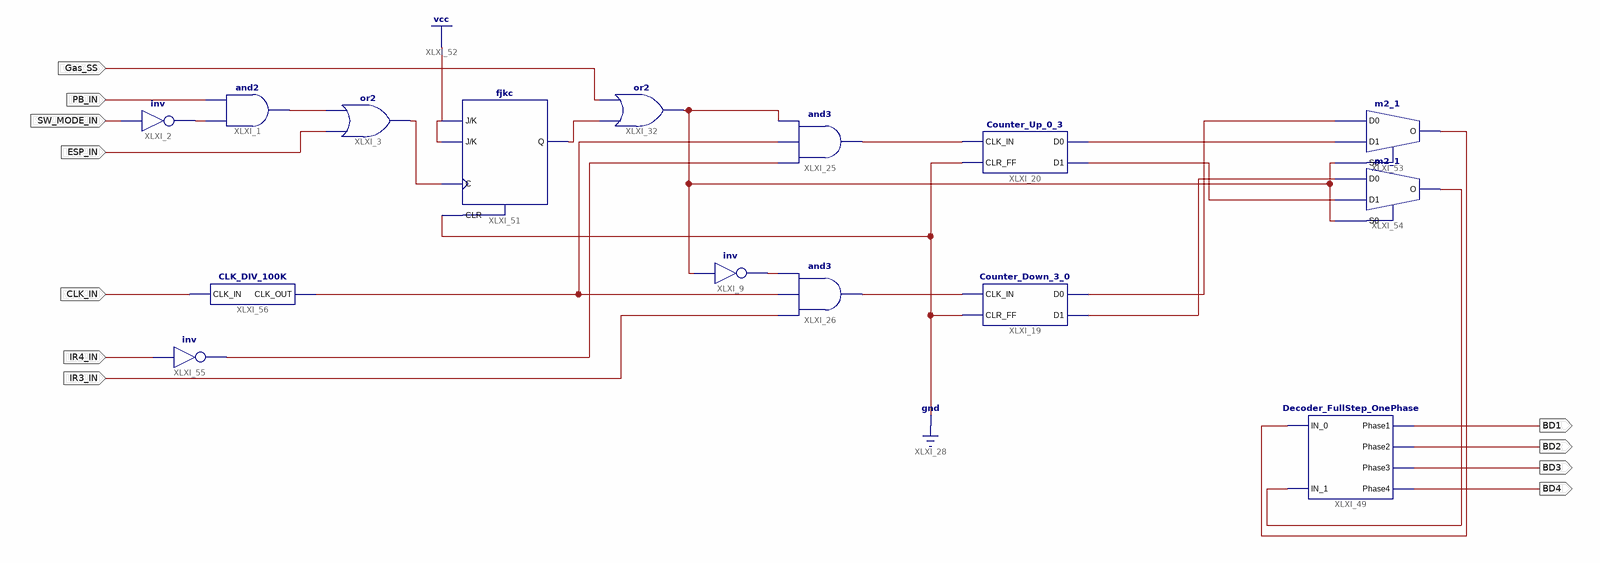
[diagram p0: schematic sheet 1]
// Xilinx ISE schematic Kitchen_Curtain_V5.sch (spartan6) as structural Verilog: 15 symbols, 11 ports
module Kitchen_Curtain_V5 (
  input  PB_IN,
  input  SW_MODE_IN,
  input  ESP_IN,
  input  IR3_IN,
  input  Gas_SS,
  input  IR4_IN,
  input  CLK_IN,
  output BD1,
  output BD2,
  output BD3,
  output BD4
);

  wire XLXN_1, XLXN_6, XLXN_8, XLXN_9, XLXN_10, XLXN_34, XLXN_40, XLXN_78, XLXN_91, XLXN_92, XLXN_94,
       XLXN_95, XLXN_96, XLXN_98, XLXN_100, XLXN_102;

  and XLXI_1 (XLXN_6, XLXN_1, PB_IN);
  not XLXI_2 (XLXN_1, SW_MODE_IN);
  or XLXI_3 (XLXN_78, ESP_IN, XLXN_6);
  Counter_Down_3_0 XLXI_19 (.CLK_IN(XLXN_9), .CLR_FF(1'b0), .D0(XLXN_94), .D1(XLXN_95));
  Counter_Up_0_3 XLXI_20 (.CLK_IN(XLXN_8), .CLR_FF(1'b0), .D0(XLXN_91), .D1(XLXN_92));
  and XLXI_26 (XLXN_9, IR3_IN, XLXN_102, XLXN_10);
  and XLXI_25 (XLXN_8, XLXN_100, XLXN_102, XLXN_40);
  not XLXI_9 (XLXN_10, XLXN_40);
  or XLXI_32 (XLXN_40, XLXN_34, Gas_SS);
  fjkc XLXI_51 (.C(XLXN_78), .CLR(1'b0), .J(1'b1), .K(1'b1), .Q(XLXN_34));
  Decoder_FullStep_OnePhase XLXI_49 (
    .IN_0(XLXN_96), .IN_1(XLXN_98), .Phase1(BD1), .Phase2(BD2), .Phase3(BD3), .Phase4(BD4));
  m2_1 XLXI_53 (.D0(XLXN_94), .D1(XLXN_91), .S0(XLXN_40), .O(XLXN_96));
  m2_1 XLXI_54 (.D0(XLXN_95), .D1(XLXN_92), .S0(XLXN_40), .O(XLXN_98));
  not XLXI_55 (XLXN_100, IR4_IN);
  CLK_DIV_100K XLXI_56 (.CLK_IN(CLK_IN), .CLK_OUT(XLXN_102));
endmodule
